# Altium schematic sheet VoltageRegulator.SchDoc
size A; SheetNumber: 4; SheetTotal: 4
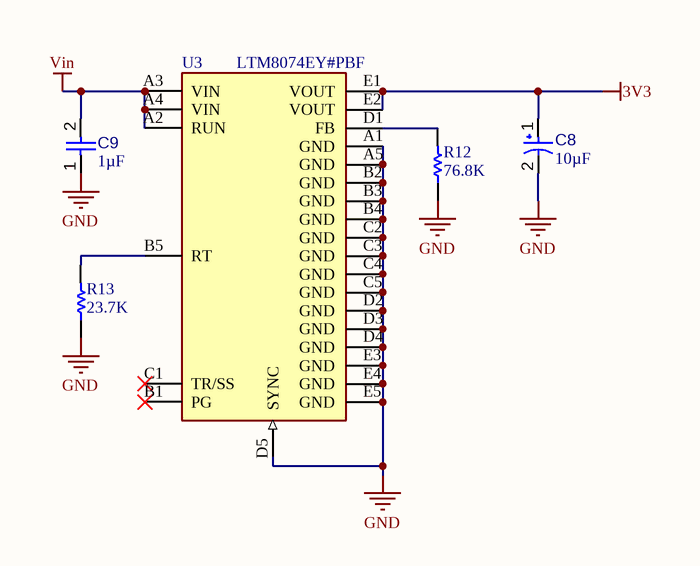
[diagram p0: VoltageRegulator.SchDoc]

## Parts
C8  value 10µF  [CAPMP3217X18-T_V]  (hidden comment: TAJA106K016RNJ)
C9  value 1µF  [CAPC0603(1608)100_L]  (hidden comment: Capacitor 1µF +/-40% 50V 0603)
R12  76.8K  [RESC1609X50X30ML10T20]
R13  23.7K  [RESC1608X55X30ML15T15]
U3  LTM8074EY#PBF  [FP-BGA-25-05-08-1566-MFG]

## Nets
3V3: C8.1 U3.E1(VOUT) U3.E2(VOUT)
GND: C8.2 C9.1 R12.1 R13.1 U3.A1(GND) U3.A5(GND) U3.B2(GND) U3.B3(GND) U3.B4(GND) U3.C2(GND) U3.C3(GND) U3.C4(GND) U3.C5(GND) U3.D2(GND) U3.D3(GND) U3.D4(GND) U3.D5(SYNC) U3.E3(GND) U3.E4(GND) U3.E5(GND)
Vin: C9.2 U3.A2(RUN) U3.A3(VIN) U3.A4(VIN)
NetR12_2: R12.2 U3.D1(FB)
NetR13_2: R13.2 U3.B5(RT)

Not connected (* = marked no-connect by the designer): U3 B1(PG)* C1(TR/SS)*

## Library data of the parts
C8 = CMP-001-00041-6: Standard Tantalum, 10 uF, +/- 10%, 16 V, -55 to 125 degC, 1206 (3216 Metric), RoHS, Tape and Reel; Manufacturer: AVX; Voltage Rating: 16V; ESR: 3Ohm; RoHS Compliant: True; Tolerance: 10%; Mounting Technology: SM; Min Operating Temperature: -55°C; Capacitor Type: Tantalum; Max Operating Temperature: 125°C; Case/Package: 1206; Pins: 2; Datasheet URL: http://datasheets.avx.com/TAJ.pdf; Datasheet Version: Feb-16; Manufacturer URL: http://www.avx.com/; Package Description: 2-Pin Surface Mount Device, Body 3.2 x 1.65 mm; Package Quantity: 1; Package Reference: CAPMP3217X18-T; Package URL: http://www.avx.com/download/software/literature/AVX-Footprint-Library.pdf; Packaging: TapeandReel
C9 = CMP-001-00078-3: Chip Capacitor, 1µF +/-40%, 50V, 0603, Thickness 1 mm; Tolerance: 10%; Voltage Rating: 50V; Mounting Technology: SMT; Max Operating Temperature: 85°C; Case/Package: 0603; Pins: 2; Min Operating Temperature: -55°C
R12 = CMP-1012-00723-2: Part Number: CRCW060376K8FKEA; Manufacturer: Vishay Dale
R13 = CMP-2000-00357-1: Part Number: ERJ-3EKF2372V; Manufacturer: Panasonic
U3 = CMP-09139-000015-1: IC REG BUCK ADJ 1.2A 25BGA; Manufacturer: Analog Devices; Output Type: AdjustableProgrammable; Standoff Height: 0.23mm; Number Of Outputs: 1; Min Supply Voltage: 3.2V; Switching Frequency: 200-2200kHz; Max Junction Temp: +125°C; Output Voltage: 0.8-12V; Nominal Supply Current: 3-8uA; Max Supply Voltage: 40V; Output Current: 1.2A; Lead Free: Yes; Device Class L3: Voltage Regulators - Switching; Device Class L1: Integrated Circuits (ICs); Ipc Land Pattern Name: BGA25N65P5X5_400X400X182; Temperature Range Low: -40°C; Category: IC; Automotive: No; Height: 1.98mm; Device Class L2: Power Management ICs; Switching Topology: Buck; Temperature Range High: +125°C; Digikey Description: IC REG BUCK ADJ 1.2A 25BGA; RoHS: TRUE; Temperature: -40°C to +125°C; ComponentLink2Description: Datasheet; Octopart: https://octopart.com/ltm8074ey%23pbf-analog+devices-95880170; Manufacturer Part Number: LTM8074EY#PBF; Mouser Description: Conv DC-DC 3.2V to 40V Step Down Single-Out 0.8V to 12V 1.2A uModule Automotive 25-Pin BGA Tray; ComponentLink2URL: https://www.analog.com/media/en/technical-documentation/data-sheets/LTM8074.pdf; Package: BGA-25-05-08-1566